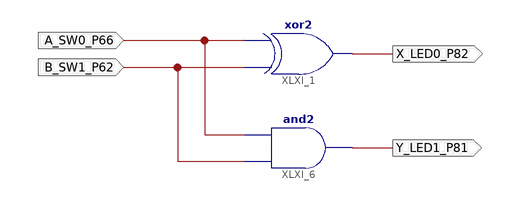
[diagram p0: schematic sheet 1]
// Xilinx ISE schematic HalfAdder.sch (spartan6) as structural Verilog: 2 symbols, 4 ports
module HalfAdder (
  input  B_SW1_P62,
  input  A_SW0_P66,
  output X_LED0_P82,
  output Y_LED1_P81
);

  xor XLXI_1 (X_LED0_P82, B_SW1_P62, A_SW0_P66);
  and XLXI_6 (Y_LED1_P81, B_SW1_P62, A_SW0_P66);
endmodule
